# Altium schematic sheet analog_power.SchDoc
size A3
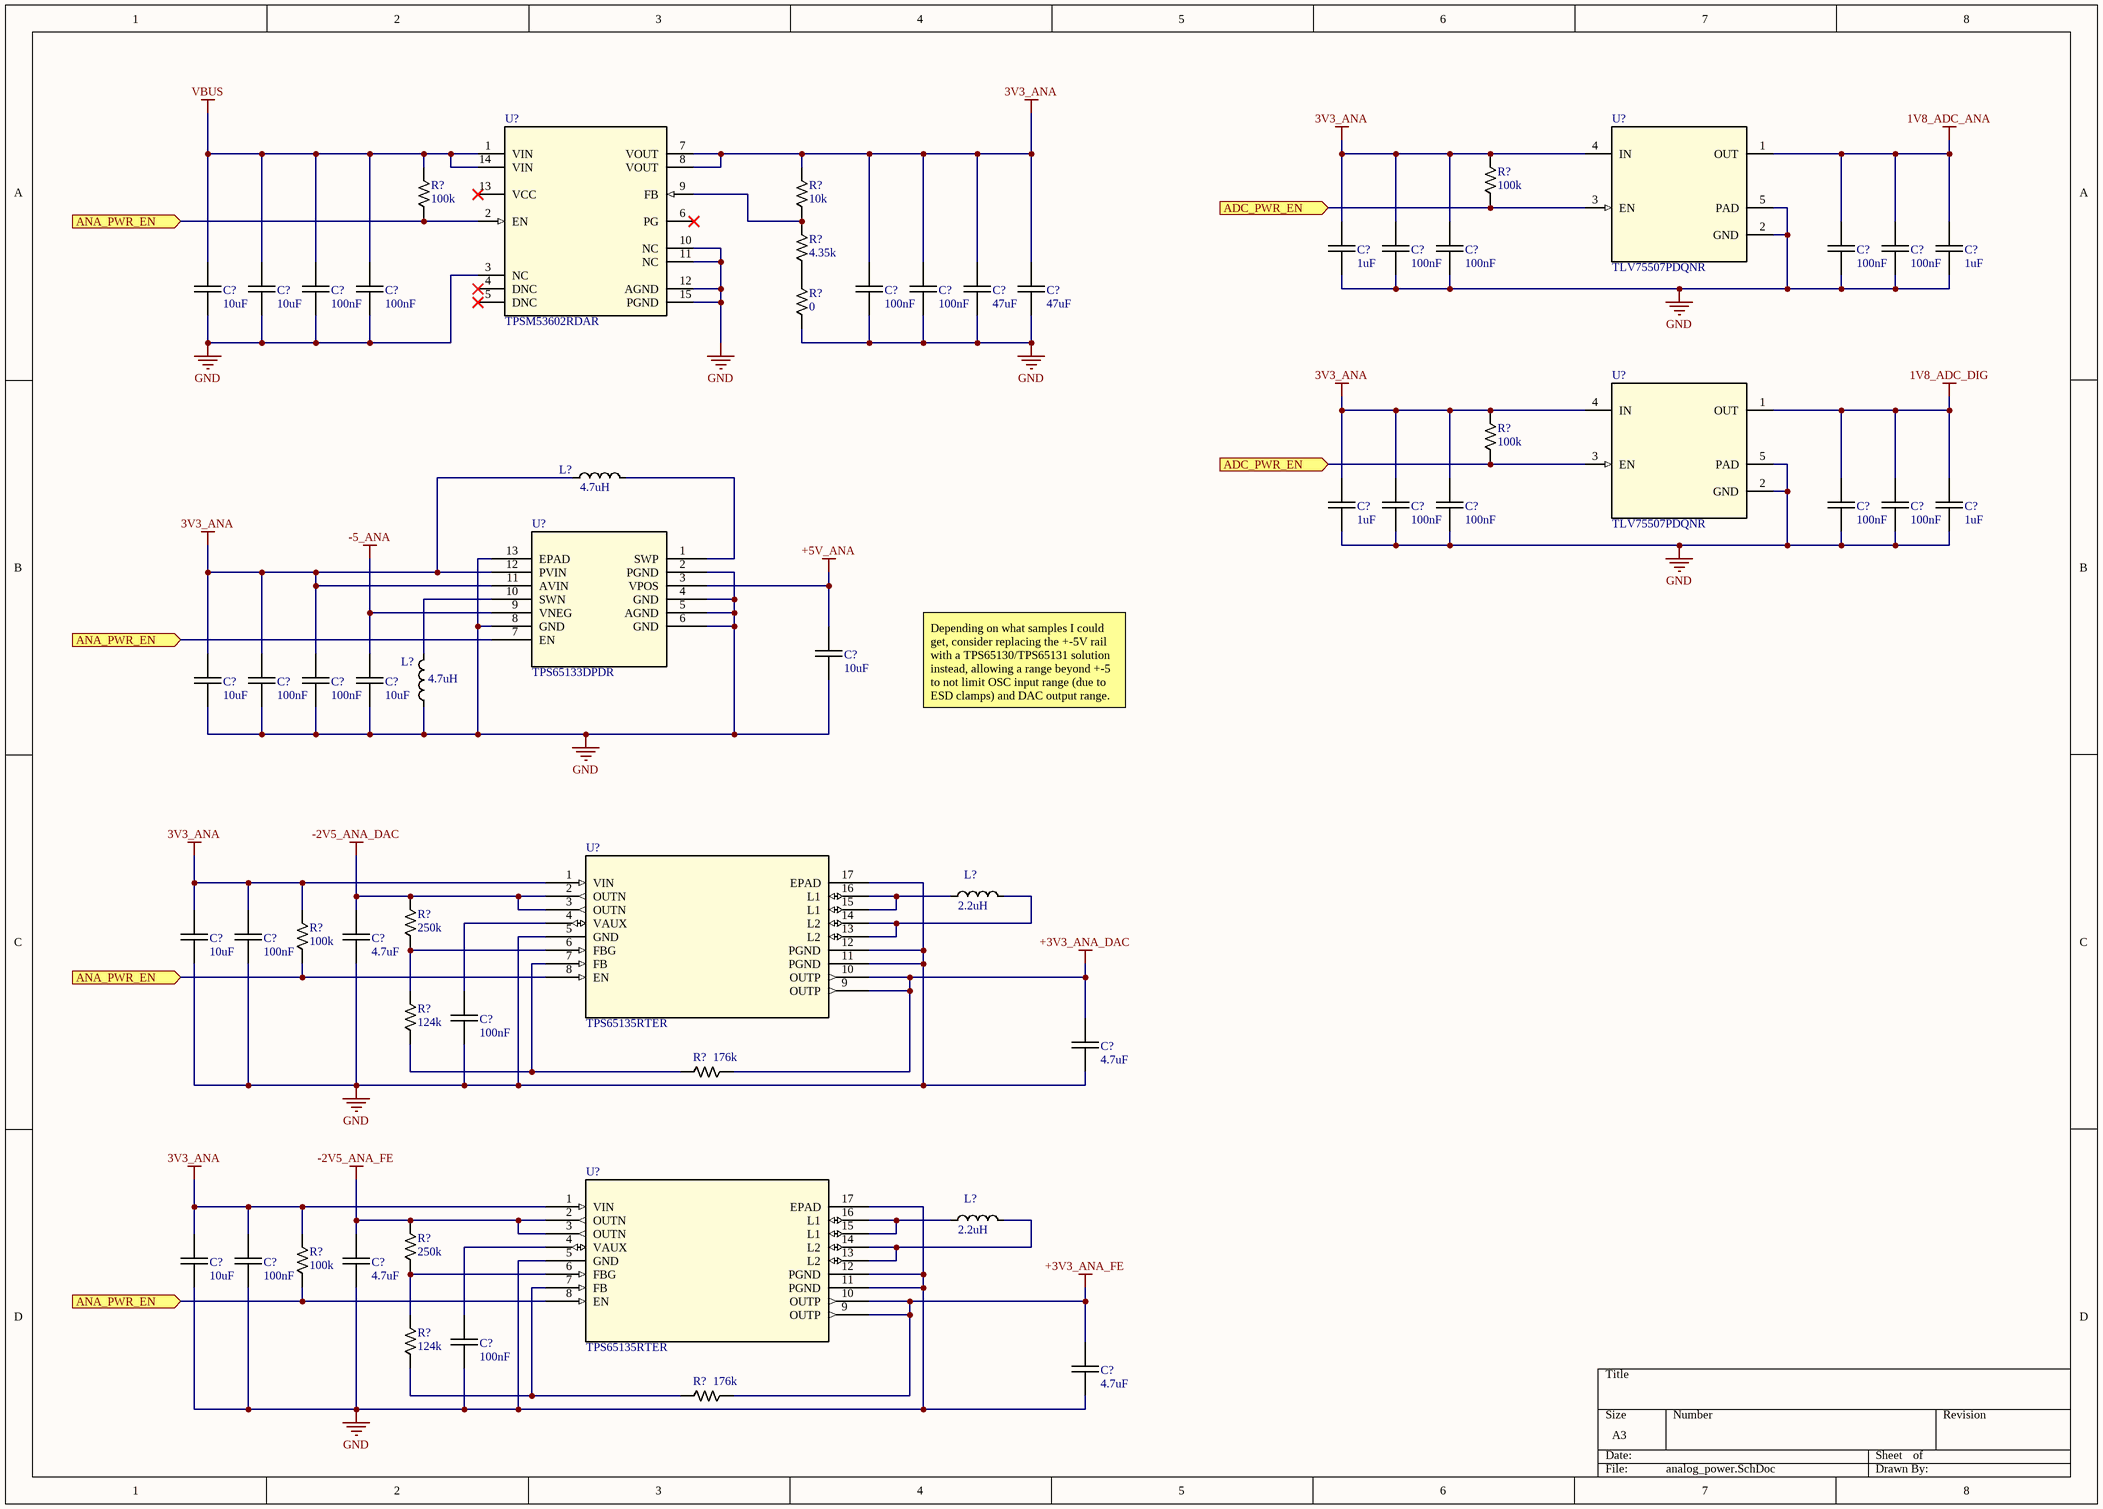
[diagram p0: analog_power.SchDoc]

## Parts
(Parts that share a designator on the sheet are numbered #1, #2 ... from top to bottom, then left to right.)
C?#1  value 1uF  [CAPC1005X06N]  (hidden comment: MLLC Capacitor)
C?#2  value 100nF  [CAPC1005X06N]  (hidden comment: MLLC Capacitor)
C?#3  value 100nF  [CAPC1005X06N]  (hidden comment: MLLC Capacitor)
C?#4  value 100nF  [CAPC1005X06N]  (hidden comment: MLLC Capacitor)
C?#5  value 100nF  [CAPC1005X06N]  (hidden comment: MLLC Capacitor)
C?#6  value 1uF  [CAPC1005X06N]  (hidden comment: MLLC Capacitor)
C?#7  value 10uF  [CAPC2012X14N]  (hidden comment: MLLC Capacitor)
C?#8  value 10uF  [CAPC2012X14N]  (hidden comment: MLLC Capacitor)
C?#9  value 100nF  [CAPC1005X06N]  (hidden comment: MLLC Capacitor)
C?#10  value 100nF  [CAPC1005X06N]  (hidden comment: MLLC Capacitor)
C?#11  value 100nF  [CAPC1005X06N]  (hidden comment: MLLC Capacitor)
C?#12  value 100nF  [CAPC1005X06N]  (hidden comment: MLLC Capacitor)
C?#13  value 47uF  [CAPC2012X14N]  (hidden comment: MLLC Capacitor)
C?#14  value 47uF  [CAPC2012X14N]  (hidden comment: MLLC Capacitor)
C?#15  value 1uF  [CAPC1005X06N]  (hidden comment: MLLC Capacitor)
C?#16  value 100nF  [CAPC1005X06N]  (hidden comment: MLLC Capacitor)
C?#17  value 100nF  [CAPC1005X06N]  (hidden comment: MLLC Capacitor)
C?#18  value 100nF  [CAPC1005X06N]  (hidden comment: MLLC Capacitor)
C?#19  value 100nF  [CAPC1005X06N]  (hidden comment: MLLC Capacitor)
C?#20  value 1uF  [CAPC1005X06N]  (hidden comment: MLLC Capacitor)
C?#21  value 10uF  [CAPC1608X09N]  (hidden comment: MLLC Capacitor)
C?#22  value 10uF  [CAPC1608X09N]  (hidden comment: MLLC Capacitor)
C?#23  value 100nF  [CAPC1005X06N]  (hidden comment: MLLC Capacitor)
C?#24  value 100nF  [CAPC1005X06N]  (hidden comment: MLLC Capacitor)
C?#25  value 10uF  [CAPC1608X09N]  (hidden comment: MLLC Capacitor)
C?#26  value 10uF  [CAPC1608X09N]  (hidden comment: MLLC Capacitor)
C?#27  value 100nF  [CAPC1005X06N]  (hidden comment: MLLC Capacitor)
C?#28  value 4.7uF  [CAPC1608X09N]  (hidden comment: MLLC Capacitor)
C?#29  value 100nF  [CAPC1005X06N]  (hidden comment: MLLC Capacitor)
C?#30  value 4.7uF  [CAPC1608X09N]  (hidden comment: MLLC Capacitor)
C?#31  value 10uF  [CAPC1608X09N]  (hidden comment: MLLC Capacitor)
C?#32  value 100nF  [CAPC1005X06N]  (hidden comment: MLLC Capacitor)
C?#33  value 4.7uF  [CAPC1608X09N]  (hidden comment: MLLC Capacitor)
C?#34  value 100nF  [CAPC1005X06N]  (hidden comment: MLLC Capacitor)
C?#35  value 4.7uF  [CAPC1608X09N]  (hidden comment: MLLC Capacitor)
L?#1  value 4.7uH  [INDC2520X12N]  (hidden comment: Chip Inductor)
L?#2  value 4.7uH  [INDC2520X12N]  (hidden comment: Chip Inductor)
L?#3  value 2.2uH  [INDC2520X12N]  (hidden comment: Chip Inductor)
L?#4  value 2.2uH  [INDC2520X12N]  (hidden comment: Chip Inductor)
R?#1  value 100k  [RESC1005X04N]  (hidden comment: Chip Resistor)
R?#2  value 100k  [RESC1005X04N]  (hidden comment: Chip Resistor)
R?#3  value 10k  [RESC1005X04N]  (hidden comment: Chip Resistor)
R?#4  value 4.35k  [RESC1005X04N]  (hidden comment: Chip Resistor)
R?#5  value 0  [RESC1005X04N]  (hidden comment: Chip Resistor)
R?#6  value 100k  [RESC1005X04N]  (hidden comment: Chip Resistor)
R?#7  value 250k  [RESC1005X04N]  (hidden comment: Chip Resistor)
R?#8  value 100k  [RESC1005X04N]  (hidden comment: Chip Resistor)
R?#9  value 124k  [RESC1005X04N]  (hidden comment: Chip Resistor)
R?#10  value 176k  [RESC1005X04N]  (hidden comment: Chip Resistor)
R?#11  value 250k  [RESC1005X04N]  (hidden comment: Chip Resistor)
R?#12  value 100k  [RESC1005X04N]  (hidden comment: Chip Resistor)
R?#13  value 124k  [RESC1005X04N]  (hidden comment: Chip Resistor)
R?#14  value 176k  [RESC1005X04N]  (hidden comment: Chip Resistor)
U?#1  TLV75507PDQNR  [DQN0004A]
U?#2  TPSM53602RDAR  [RDA0015A]
U?#3  TLV75507PDQNR  [DQN0004A]
U?#4  TPS65133DPDR  [DPD12_TEX]
U?#5  TPS65135RTER  [RTE16_1P7X1P7]
U?#6  TPS65135RTER  [RTE16_1P7X1P7]

## Ports
ADC_PWR_EN (in), ANA_PWR_EN (in)

## Nets
1V8_ADC_ANA: C?#4.1 C?#5.1 C?#6.1 U?#1.1(OUT)
1V8_ADC_DIG: C?#18.1 C?#19.1 C?#20.1 U?#3.1(OUT)
3V3_ANA: C?#1.1 C?#2.1 C?#3.1 C?#11.1 C?#12.1 C?#13.1 C?#14.1 C?#15.1 C?#16.1 C?#17.1 C?#22.1 C?#23.1 C?#24.1 C?#26.1 C?#27.1 C?#31.1 C?#32.1 L?#1.1 R?#1.2 R?#3.2 R?#6.2 R?#8.2 R?#12.2 U?#1.4(IN) U?#2.7(VOUT) U?#2.8(VOUT) U?#3.4(IN) U?#4.11(AVIN) U?#4.12(PVIN) U?#5.1(VIN) U?#6.1(VIN)
+3V3_ANA_DAC: C?#30.1 R?#10.1 U?#5.9(OUTP) U?#5.10(OUTP)
+3V3_ANA_FE: C?#35.1 R?#14.1 U?#6.9(OUTP) U?#6.10(OUTP)
+5V_ANA: C?#21.1 U?#4.3(VPOS)
-2V5_ANA_DAC: C?#28.1 R?#7.2 U?#5.2(OUTN) U?#5.3(OUTN)
-2V5_ANA_FE: C?#33.1 R?#11.2 U?#6.2(OUTN) U?#6.3(OUTN)
-5_ANA: C?#25.1 U?#4.9(VNEG)
GND: C?#1.2 C?#2.2 C?#3.2 C?#4.2 C?#5.2 C?#6.2 C?#7.2 C?#8.2 C?#9.2 C?#10.2 C?#11.2 C?#12.2 C?#13.2 C?#14.2 C?#15.2 C?#16.2 C?#17.2 C?#18.2 C?#19.2 C?#20.2 C?#21.2 C?#22.2 C?#23.2 C?#24.2 C?#25.2 C?#26.2 C?#27.2 C?#28.2 C?#29.2 C?#30.2 C?#31.2 C?#32.2 C?#33.2 C?#34.2 C?#35.2 L?#2.1 R?#5.1 U?#1.2(GND) U?#1.5(PAD) U?#2.3(NC) U?#2.10(NC) U?#2.11(NC) U?#2.12(AGND) U?#2.15(PGND) U?#3.2(GND) U?#3.5(PAD) U?#4.2(PGND) U?#4.4(GND) U?#4.5(AGND) U?#4.6(GND) U?#4.8(GND) U?#4.13(EPAD) U?#5.5(GND) U?#5.11(PGND) U?#5.12(PGND) U?#5.17(EPAD) U?#6.5(GND) U?#6.11(PGND) U?#6.12(PGND) U?#6.17(EPAD)
VBUS: C?#7.1 C?#8.1 C?#9.1 C?#10.1 R?#2.2 U?#2.1(VIN) U?#2.14(VIN)
ADC_PWR_EN: R?#1.1 R?#6.1 U?#1.3(EN) U?#3.3(EN) ; port ADC_PWR_EN
ANA_PWR_EN: R?#2.1 R?#8.1 R?#12.1 U?#2.2(EN) U?#4.7(EN) U?#5.8(EN) U?#6.8(EN) ; port ANA_PWR_EN
NetC?#29_1: C?#29.1 U?#5.4(VAUX)
NetC?#34_1: C?#34.1 U?#6.4(VAUX)
NetL?#1_2: L?#1.2 U?#4.1(SWP)
NetL?#2_2: L?#2.2 U?#4.10(SWN)
NetL?#3_1: L?#3.1 U?#5.15(L1) U?#5.16(L1)
NetL?#3_2: L?#3.2 U?#5.13(L2) U?#5.14(L2)
NetL?#4_1: L?#4.1 U?#6.15(L1) U?#6.16(L1)
NetL?#4_2: L?#4.2 U?#6.13(L2) U?#6.14(L2)
NetR?#3_1: R?#3.1 R?#4.2 U?#2.9(FB)
NetR?#4_1: R?#4.1 R?#5.2
NetR?#7_1: R?#7.1 R?#9.2 U?#5.6(FBG)
NetR?#9_1: R?#9.1 R?#10.2 U?#5.7(FB)
NetR?#11_1: R?#11.1 R?#13.2 U?#6.6(FBG)
NetR?#13_1: R?#13.1 R?#14.2 U?#6.7(FB)

Not connected (* = marked no-connect by the designer): U?#2 4(DNC)* 5(DNC)* 6(PG)* 13(VCC)*

## Notes on the sheet
- Depending on what samples I could get, consider replacing the +-5V rail with a TPS65130/TPS65131 solution instead, allowing a range beyond +-5 to not limit OSC input range (due to ESD clamps) and DAC output range.

## Library data of the parts
C?#1-C?#35 = Cap: Rating: *
L?#1-L?#4 = Ind: muRata 1239as-h-4r7m
R?#1-R?#14 = Res
U?#1 U?#3 = TLV755P: Fixed output, 500-mA, high-PSRR, low-IQ, low-dropout voltage regulator with enable; PartNumber: TLV75533PDQNR; Manufacturer: Texas Instruments; RefDes: RefDes; Type: DEV; Value: Value; Copyright: Copyright (C) 2018 Accelerated Designs. All rights reserved; ComponentLink1Description: Product Page; ComponentLink1URL: https://www.ti.com/product/TLV755P
U?#2 = TPSM53602: 36-V, 2-A step-down power module in small 5.5 x 5 x 4-mm Enhanced HotRod™ QFN with simple footprint; Manufacturer: Texas Instruments; PartNumber: TPSM53602RDAR; RefDes: RefDes; Type: DEV; Value: Value; Copyright: Copyright (C) 2018 Accelerated Designs. All rights reserved; ComponentLink1Description: Product Page; ComponentLink1URL: https://www.ti.com/product/TPSM53602
U?#4 = TPS65133: Split-Rail Converter, ±5V, 250mA Dual Output Power Supply; Vendor: Texas Instruments; Built_By: EMA_Molly; SourceLibrary: TI_2019-05-24; Manufacturer_Part_Number: TPS65133DPDR; Copyright: Copyright (C) 2018 Accelerated Designs. All rights reserved; RefDes: RefDes; Type: DEV; ComponentLink1Description: Product Page; ComponentLink1URL: https://www.ti.com/product/TPS65133
U?#5 U?#6 = TPS65135: Single-Inductor,Multiple-Output(SIMO)Regulator; Vendor: Texas Instruments; PACKAGE_DESIGNATOR: RTE; PIN_COUNT: 16; FAMILY_NAME: LCD/OLED DISPLAY BIAS SOLUTIONS; INDUSTRY_STD_PKG_TYPE: WQFN; Manufacturer_Part_Number: TPS65135RTER; GENERIC_PART_NUMBER: TPS65135; Datasheet_URL: http://www.ti.com/lit/gpn/TPS65135; Manufacturer: Texas Instruments; Copyright: Copyright (C) 2018 Accelerated Designs. All rights reserved; RefDes: RefDes; Type: Type